# EAGLE design fish_electronics3 (EAGLE 6.3)
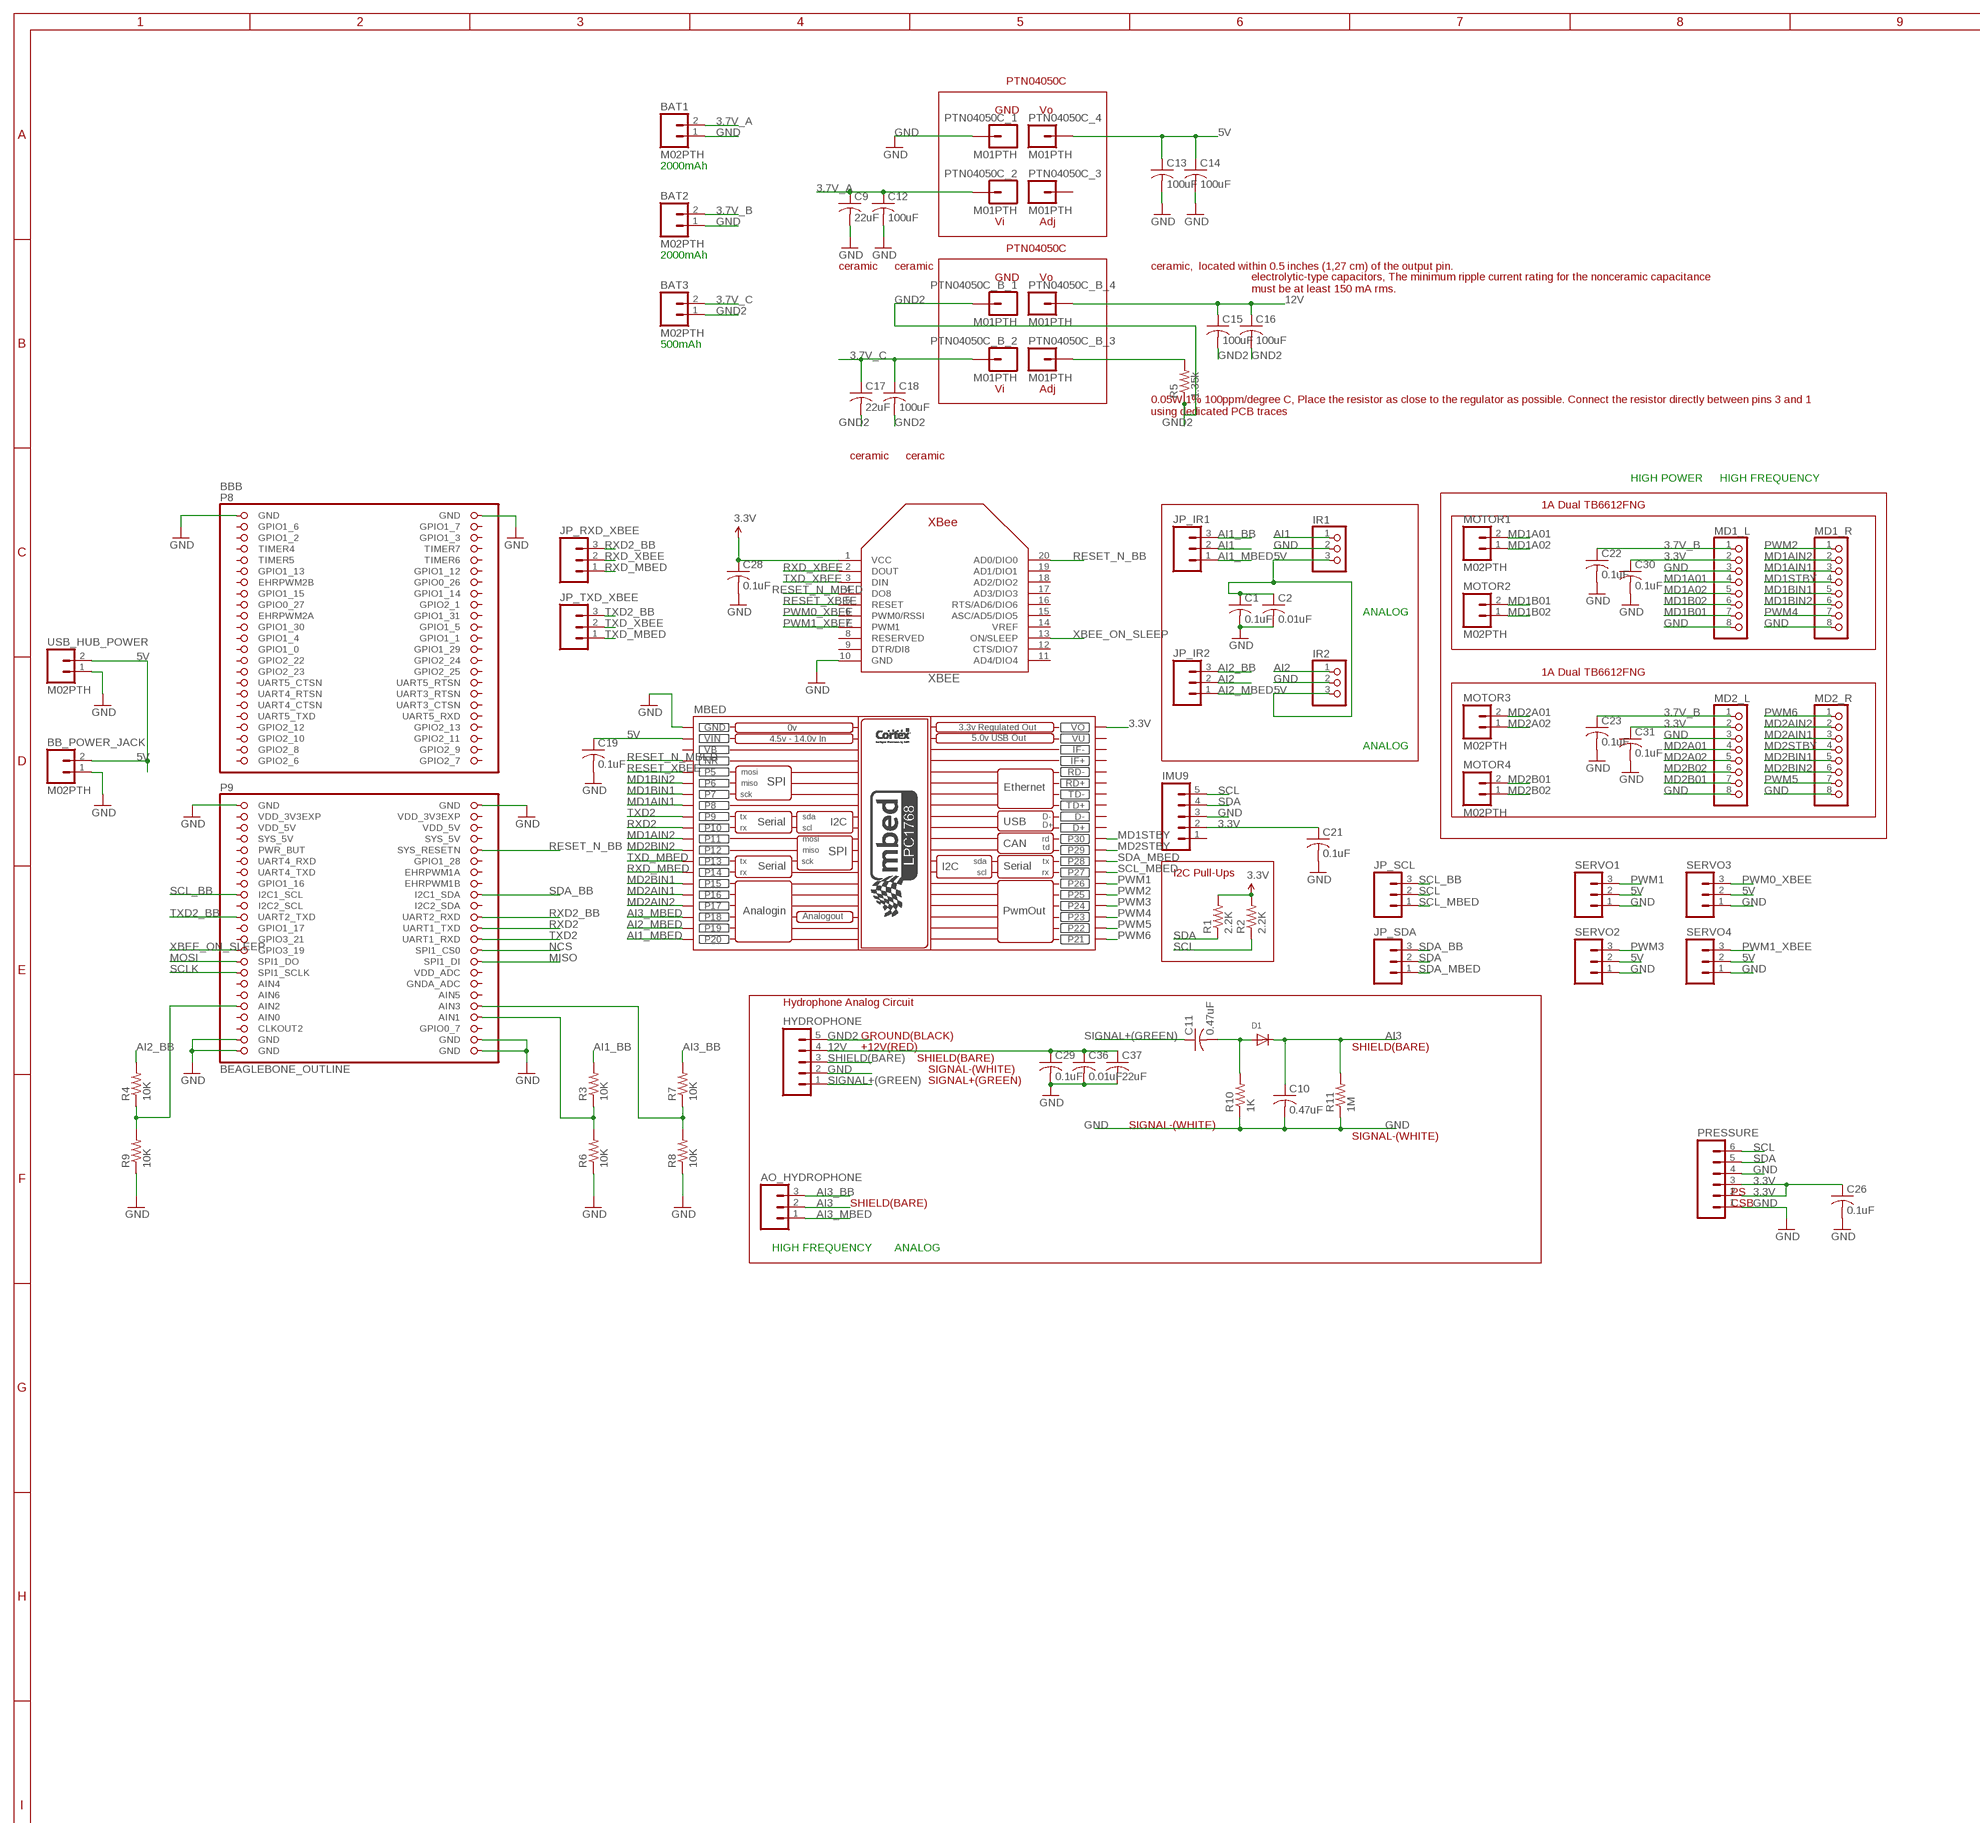
[diagram p0: schematic, sheet 1, part 1 of 2]
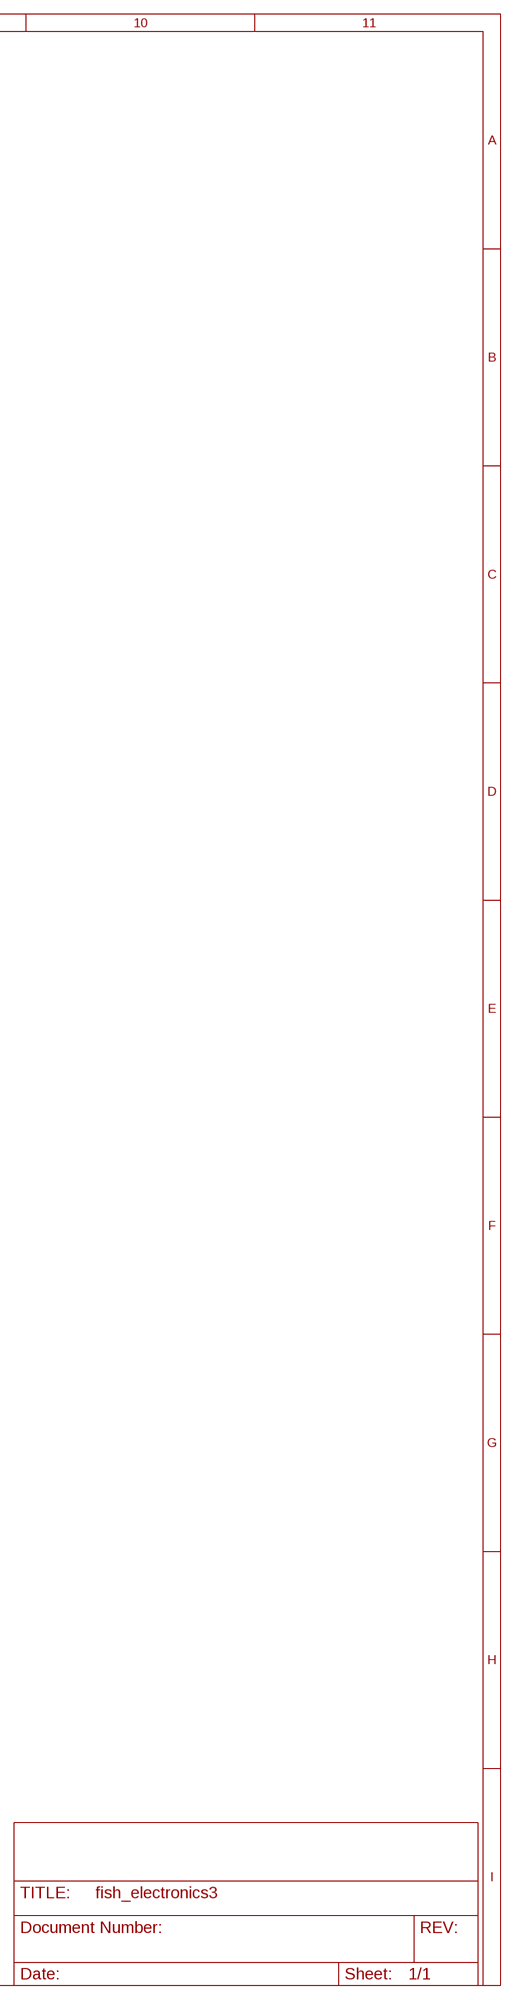
[diagram p1: schematic, sheet 1, part 2 of 2]

## Parts
AO_HYDROPHONE  M03PTH  [1X03]
BAT1  M02PTH  [1X02]
BAT2  M02PTH  [1X02]
BAT3  M02PTH  [1X02]
BB_POWER_JACK  M02PTH  [1X02]
BBB  BEAGLEBONE_OUTLINE  [BEAGLEBONE_SHIELD]
C1  0.1uF  C-USC0805  [C0805]
C2  0.01uF  C-USC0805  [C0805]
C9  22uF  C-USC0805  [C0805]
C10  0.47uF  C-USC0805  [C0805]
C11  0.47uF  C-USC0805  [C0805]
C12  100uF  C-USC1206  [C1206]
C13  100uF  C-USC1206  [C1206]
C14  100uF  C-USC1206  [C1206]
C15  100uF  C-USC1210  [C1210]
C16  100uF  C-USC1210  [C1210]
C17  22uF  C-USC0805  [C0805]
C18  100uF  C-USC1206  [C1206]
C19  0.1uF  C-USC0805  [C0805]
C21  0.1uF  C-USC0805  [C0805]
C22  0.1uF  C-USC0805  [C0805]
C23  0.1uF  C-USC0805  [C0805]
C26  0.1uF  C-USC0805  [C0805]
C28  0.1uF  C-USC0805  [C0805]
C29  0.1uF  C-USC0805  [C0805]
C30  0.1uF  C-USC0805  [C0805]
C31  0.1uF  C-USC0805  [C0805]
C36  0.01uF  C-USC0805  [C0805]
C37  22uF  C-USC0805  [C0805]
D1  DIODESOT23_WAVE  [SOT23-W]
HYDROPHONE  M05PTH  [1X05]
IMU9  M05PTH  [1X05]
IR1  PINHD-1X3CB  [1X03-CLEANBIG]
IR2  PINHD-1X3CB  [1X03-CLEANBIG]
JP_IR1  M03PTH  [1X03]
JP_IR2  M03PTH  [1X03]
JP_RXD_XBEE  M03PTH  [1X03]
JP_SCL  M03PTH  [1X03]
JP_SDA  M03PTH  [1X03]
JP_TXD_XBEE  M03PTH  [1X03]
MBED  MBED_NXP_LPC1768  [MBED-KIT]
MD1_L  PINHD-1X8  [1X08]
MD1_R  PINHD-1X8  [1X08]
MD2_L  PINHD-1X8  [1X08]
MD2_R  PINHD-1X8  [1X08]
MOTOR1  M02PTH  [1X02]
MOTOR2  M02PTH  [1X02]
MOTOR3  M02PTH  [1X02]
MOTOR4  M02PTH  [1X02]
PRESSURE  M06SIP  [1X06]
PTN04050C_1  M01PTH  [1X01]
PTN04050C_2  M01PTH  [1X01]
PTN04050C_3  M01PTH  [1X01]
PTN04050C_4  M01PTH  [1X01]
PTN04050C_B_1  M01PTH  [1X01]
PTN04050C_B_2  M01PTH  [1X01]
PTN04050C_B_3  M01PTH  [1X01]
PTN04050C_B_4  M01PTH  [1X01]
R1  2.2K  R-US_R0805  [R0805]
R2  2.2K  R-US_R0805  [R0805]
R3  10K  R-US_R0805  [R0805]
R4  10K  R-US_R0805  [R0805]
R5  1.35k  R-US_R0805  [R0805]
R6  10K  R-US_R0805  [R0805]
R7  10K  R-US_R0805  [R0805]
R8  10K  R-US_R0805  [R0805]
R9  10K  R-US_R0805  [R0805]
R10  1K  R-US_R0805  [R0805]
R11  1M  R-US_R0805  [R0805]
SERVO1  M03PTH  [1X03]
SERVO2  M03PTH  [1X03]
SERVO3  M03PTH  [1X03]
SERVO4  M03PTH  [1X03]
USB_HUB_POWER  M02PTH  [1X02]
XBEE  XBEE  [XBEE]

## Nets
3.3V: C21.1 C26.1 C28.1 C30.1 C31.1 IMU9.2 MBED.VOUT(VO) MD1_L.2 MD2_L.2 PRESSURE.2 PRESSURE.3 R1.2 R2.2 XBEE.1(VCC)
3.7V_A: BAT1.2 C9.1 C12.1 PTN04050C_2.1
3.7V_B: BAT2.2 C22.1 C23.1 MD1_L.1 MD2_L.1
3.7V_C: BAT3.2 C17.1 C18.1 PTN04050C_B_2.1
5V: BB_POWER_JACK.2 C1.1 C2.1 C13.1 C14.1 C19.1 IR1.3 IR2.3 MBED.VIN PTN04050C_4.1 SERVO1.2 SERVO2.2 SERVO3.2 SERVO4.2 USB_HUB_POWER.2
12V: C15.1 C16.1 C29.1 C36.1 C37.1 HYDROPHONE.4 PTN04050C_B_4.1
AI1: IR1.1 JP_IR1.2
AI1_BB: JP_IR1.3 R3.2
AI1_MBED: JP_IR1.1 MBED.P$20(P20)
AI2: IR2.1 JP_IR2.2
AI2_BB: JP_IR2.3 R4.2
AI2_MBED: JP_IR2.1 MBED.P$19(P19)
AI3: AO_HYDROPHONE.2 C10.1 D1.3(C) R11.2
AI3_BB: AO_HYDROPHONE.3 R7.2
AI3_MBED: AO_HYDROPHONE.1 MBED.P$18(P18)
GND: BAT1.1 BAT2.1 BB_POWER_JACK.1 BBB.1(GND) BBB.2(GND) BBB.47(GND) BBB.48(GND) BBB.89(GND) BBB.90(GND) BBB.91(GND) BBB.92(GND) C1.2 C2.2 C9.2 C10.2 C12.2 C13.2 C14.2 C19.2 C21.2 C22.2 C23.2 C26.2 C28.2 C29.2 C30.2 C31.2 C36.2 C37.2 HYDROPHONE.2 IMU9.3 IR1.2 IR2.2 MBED.GND MD1_L.3 MD1_L.8 MD1_R.8 MD2_L.3 MD2_L.8 MD2_R.8 PRESSURE.1 PRESSURE.4 PTN04050C_1.1 R6.1 R8.1 R9.1 R10.1 R11.1 SERVO1.1 SERVO2.1 SERVO3.1 SERVO4.1 USB_HUB_POWER.1 XBEE.10(GND)
GND2: BAT3.1 C15.2 C16.2 C17.2 C18.2 HYDROPHONE.5 PTN04050C_B_1.1 R5.1
MD1A01: MD1_L.4 MOTOR1.2
MD1A02: MD1_L.5 MOTOR1.1
MD1AIN1: MBED.P$8(P8) MD1_R.3
MD1AIN2: MBED.P$11(P11) MD1_R.2
MD1B01: MD1_L.7 MOTOR2.2
MD1B02: MD1_L.6 MOTOR2.1
MD1BIN1: MBED.P$7(P7) MD1_R.5
MD1BIN2: MBED.P$6(P6) MD1_R.6
MD1STBY: MBED.P$30(P30) MD1_R.4
MD2A01: MD2_L.4 MOTOR3.2
MD2A02: MD2_L.5 MOTOR3.1
MD2AIN1: MBED.P$16(P16) MD2_R.3
MD2AIN2: MBED.P$17(P17) MD2_R.2
MD2B01: MD2_L.7 MOTOR4.2
MD2B02: MD2_L.6 MOTOR4.1
MD2BIN1: MBED.P$15(P15) MD2_R.5
MD2BIN2: MBED.P$12(P12) MD2_R.6
MD2STBY: MBED.P$29(P29) MD2_R.4
MISO: BBB.76(SPI1_DI)
MOSI: BBB.75(SPI1_DO)
N$3: BBB.86(AIN1) R3.1 R6.2
N$4: PTN04050C_B_3.1 R5.2
N$6: BBB.84(AIN3) R7.1 R8.2
N$7: BBB.83(AIN2) R4.1 R9.2
N$10: C11.2 D1.1(A) R10.2
NCS: BBB.74(SPI1_CS0)
PWM0_XBEE: SERVO3.3 XBEE.6(PWM0/RSSI)
PWM1: MBED.P$26(P26) SERVO1.3
PWM1_XBEE: SERVO4.3 XBEE.7(PWM1)
PWM2: MBED.P$25(P25) MD1_R.1
PWM3: MBED.P$24(P24) SERVO2.3
PWM4: MBED.P$23(P23) MD1_R.7
PWM5: MBED.P$22(P22) MD2_R.7
PWM6: MBED.P$21(P21) MD2_R.1
RESET_N_BB: BBB.56(SYS_RESETN) XBEE.20(AD0/DIO0)
RESET_N_MBED: MBED.NR XBEE.4(DO8)
RESET_XBEE: MBED.P$5(P5) XBEE.5(RESET)
RXD2: BBB.70(UART1_TXD) MBED.P$10(P10)
RXD2_BB: BBB.68(UART2_RXD) JP_RXD_XBEE.3
RXD_MBED: JP_RXD_XBEE.1 MBED.P$14(P14)
RXD_XBEE: JP_RXD_XBEE.2 XBEE.2(DOUT)
SCL: IMU9.5 JP_SCL.2 PRESSURE.6 R2.1
SCL_BB: BBB.63(I2C1_SCL) JP_SCL.3
SCL_MBED: JP_SCL.1 MBED.P$27(P27)
SCLK: BBB.77(SPI1_SCLK)
SDA: IMU9.4 JP_SDA.2 PRESSURE.5 R1.1
SDA_BB: BBB.64(I2C1_SDA) JP_SDA.3
SDA_MBED: JP_SDA.1 MBED.P$28(P28)
SHIELD(BARE): HYDROPHONE.3
SIGNAL+(GREEN): C11.1 HYDROPHONE.1
TXD2: BBB.72(UART1_RXD) MBED.P$9(P9)
TXD2_BB: BBB.67(UART2_TXD) JP_TXD_XBEE.3
TXD_MBED: JP_TXD_XBEE.1 MBED.P$13(P13)
TXD_XBEE: JP_TXD_XBEE.2 XBEE.3(DIN)
XBEE_ON_SLEEP: BBB.73(GPIO3_19) XBEE.13(ON/SLEEP)
Unconnected: BBB.3(GPIO1_6) BBB.4(GPIO1_7) BBB.5(GPIO1_2) BBB.6(GPIO1_3) BBB.7(TIMER4) BBB.8(TIMER7) BBB.9(TIMER5) BBB.10(TIMER6) BBB.11(GPIO1_13) BBB.12(GPIO1_12) BBB.13(EHRPWM2B) BBB.14(GPIO0_26) BBB.15(GPIO1_15) BBB.16(GPIO1_14) BBB.17(GPIO0_27) BBB.18(GPIO2_1) BBB.19(EHRPWM2A) BBB.20(GPIO1_31) BBB.21(GPIO1_30) BBB.22(GPIO1_5) BBB.23(GPIO1_4) BBB.24(GPIO1_1) BBB.25(GPIO1_0) BBB.26(GPIO1_29) BBB.27(GPIO2_22) BBB.28(GPIO2_24) BBB.29(GPIO2_23) BBB.30(GPIO2_25) BBB.31(UART5_CTSN) BBB.32(UART5_RTSN) BBB.33(UART4_RTSN) BBB.34(UART3_RTSN) BBB.35(UART4_CTSN) BBB.36(UART3_CTSN) BBB.37(UART5_TXD) BBB.38(UART5_RXD) BBB.39(GPIO2_12) BBB.40(GPIO2_13) BBB.41(GPIO2_10) BBB.42(GPIO2_11) BBB.43(GPIO2_8) BBB.44(GPIO2_9) BBB.45(GPIO2_6) BBB.46(GPIO2_7) BBB.54(SYS_5V) BBB.55(PWR_BUT) BBB.57(UART4_RXD) BBB.58(GPIO1_28) BBB.59(UART4_TXD) BBB.60(EHRPWM1A) BBB.61(GPIO1_16) BBB.62(EHRPWM1B) BBB.65(I2C2_SCL) BBB.66(I2C2_SDA) BBB.69(GPIO1_17) BBB.71(GPIO3_21) BBB.78(VDD_ADC) BBB.79(AIN4) BBB.80(GNDA_ADC) BBB.81(AIN6) BBB.82(AIN5) BBB.87(CLKOUT2) BBB.88(GPIO0_7) IMU9.1 MBED.D+ MBED.D- MBED.IF+ MBED.IF- MBED.RD+ MBED.RD- MBED.TD+ MBED.TD- PTN04050C_3.1 XBEE.8(RESERVED) XBEE.9(DTR/DI8) XBEE.11(AD4/DIO4) XBEE.12(CTS/DIO7) XBEE.14(VREF) XBEE.15(ASC/AD5/DIO5) XBEE.16(RTS/AD6/DIO6) XBEE.17(AD3/DIO3) XBEE.18(AD2/DIO2) XBEE.19(AD1/DIO1)

## Notes on the sheet
- PTN04050C
- GND | Vo
- 2000mAh
- Vi | Adj
- PTN04050C
- 2000mAh
- ceramic | ceramic | ceramic,  located within 0.5 inches (1,27 cm) of the output pin.
- GND | Vo
- electrolytic-type capacitors, The minimum ripple current rating for the nonceramic capacitance
  must be at least 150 mA rms.
- 500mAh
- Vi | Adj
- 0.05W 1% 100ppm/degree C, Place the resistor as close to the regulator as possible. Connect the resistor directly between pins 3 and 1
  using dedicated PCB traces
- ceramic | ceramic
- HIGH POWER | HIGH FREQUENCY
- 1A Dual TB6612FNG
- ANALOG
- 1A Dual TB6612FNG
- ANALOG
- I2C Pull-Ups
- Hydrophone Analog Circuit
- GROUND(BLACK)
- +12V(RED) | SHIELD(BARE)
- SHIELD(BARE)
- SIGNAL-(WHITE)
- SIGNAL+(GREEN)
- SIGNAL-(WHITE)
- SIGNAL-(WHITE)
- PS
- SHIELD(BARE) | CSB
- HIGH FREQUENCY | ANALOG

## Power pins joined to a net without a drawn wire
AIN0: BBB.85(AIN0)
SYS_5V: BBB.53(SYS_5V)
VB: MBED.VB
VDD_3V3EXP: BBB.49(VDD_3V3EXP) BBB.50(VDD_3V3EXP)
VDD_5V: BBB.51(VDD_5V) BBB.52(VDD_5V)
VU: MBED.VU

## Library data of the parts
AO_HYDROPHONE JP_IR1 JP_IR2 JP_RXD_XBEE JP_SCL JP_SDA JP_TXD_XBEE SERVO1-SERVO4 = SparkFun:M03: Header 3 Standard 3-pin 0.1" header. Use with straight break away headers (SKU : PRT-00116), right angle break away headers (PRT-00553), swiss pins (PRT-00743), machine pins (PRT-00117), and female headers (PRT-00115). Molex polarized connector foot print use with SKU : PRT-08232 with associated crimp pins and housings.
BAT1-BAT3 BB_POWER_JACK MOTOR1-MOTOR4 USB_HUB_POWER = SparkFun-Connectors:M02: Standard 2-pin 0.1" header. Use with - straight break away headers ( PRT-00116) - right angle break away headers (PRT-00553) - swiss pins (PRT-00743) - machine pins (PRT-00117) - female headers (PRT-00115) Molex polarized connector foot print use with: PRT-08233 with associated crimp pins and housings. 2.54_SCREWTERM for use with PRT-10571. 3.5mm Screw Terminal footprints for PRT-08084 5mm Screw Terminal footprints for use with PRT-08433
BBB = adafruit2:BEAGLEBONE_OUTLINE: Should match A3 pinout - but not completely tested
C1 C2 C9-C11 C17 C19 C21-C23 C26 C28-C31 C36 C37 = rcl:C-US: CAPACITOR, American symbol
C12-C16 C18 = adafruit:C-US: CAPACITOR, American symbol
D1 = adafruit:DIODE: Diode SMADIODE - SMA Surface Mount Package 20V 1A Schottky Diode Digikey: 641-1014-6-ND DO-1N4148 - Through Hole Small Current Diode SOD-123 20V 1 A (.5mV Vf) Schottky Diode - Digikey: MBRX120TPMSCT-ND SOD-323 10V 570mA (.38mV Vf, 3ns) Schottky Diode - Digikey: ZLLS410CT-ND SOD-523 30V 30mA Schottky Diode (RB751S-40TE61) - Digikey: RB751S-40TE61CT-ND SOT23-R/W - SOT23 Package (R = Solder Paste/Reflow Ovens, W = Hand-Soldering) BAT54Film 40V 300mA - Digikey: 497-7162-1-ND
HYDROPHONE = SparkFun-Connectors:M05: Header 5 Standard 5-pin 0.1" header. Use with straight break away headers (SKU : PRT-00116), right angle break away headers (PRT-00553), swiss pins (PRT-00743), machine pins (PRT-00117), and female headers (PRT-00115). Molex polarized connector foot print use with SKU : PRT-08230 with associated crimp pins and housings.
IMU9 = SparkFun:M05: Header 5 Standard 5-pin 0.1" header. Use with straight break away headers (SKU : PRT-00116), right angle break away headers (PRT-00553), swiss pins (PRT-00743), machine pins (PRT-00117), and female headers (PRT-00115). Molex polarized connector foot print use with SKU : PRT-08230 with associated crimp pins and housings.
IR1 IR2 = adafruit:PINHD-1X3: PIN HEADER
MBED = MBED_v2.1:MBED_NXP_LPC1768: Mbed LPC1768 - ARM CORTEX v2.1 * Schematic symbol is now placed in eagles's default raster. *The pads diameter are suitable for routing between mbed pins * mbed pads are 0.8 mm drill diameter. --------------------------------------------- Created by: Mohamed Yousry *Alexandria, Egypt *Email: mohamed.yousry@ieeegoldegypt.org
MD1_L MD1_R MD2_L MD2_R = pinhead2:PINHD-1X8: PIN HEADER
PRESSURE = SparkFun-Connectors:M06: Header 6 Standard 6-pin 0.1" header. Use with straight break away headers (SKU : PRT-00116), right angle break away headers (PRT-00553), swiss pins (PRT-00743), machine pins (PRT-00117), and female headers (PRT-00115). Molex polarized connector foot print use with SKU : PRT-08094 with associated crimp pins and housings. NOTES ON THE VARIANTS LOCK and LOCK_LONGPADS... This footprint was designed to help hold the alignment of a through-hole component (i.e. 6-pin header) while soldering it into place. You may notice that each hole has been shifted either up or down by 0.005 of an inch from it's more standard position (which is a perfectly straight line). This slight alteration caused the pins (the squares in the middle) to touch the edges of the holes. Because they are alternating, it causes a "brace" to hold the component in place. 0.005 has proven to be the perfect amount of "off-center" position when using our standard breakaway headers. Although looks a little odd when you look at the bare footprint, once you have a header in there, the alteration is very hard to notice. Also,if you push a header all the way into place, it is covered up entirely on the bottom side. This idea of altering the position of holes to aid alignment will be further integrated into the Sparkfun Library for other footprints. It can help hold any component with 3 or more connection pins.
PTN04050C_1-PTN04050C_4 PTN04050C_B_1-PTN04050C_B_4 = SparkFun:M01: Header 1 Standard 1-pin 0.1" header. Use with straight break away headers (SKU : PRT-00116), right angle break away headers (PRT-00553), swiss pins (PRT-00743), machine pins (PRT-00117), and female headers (PRT-00115).
R1-R11 = rcl:R-US_: RESISTOR, American symbol
XBEE = adafruit:XBEE

## Net classes
1 Power1: width 0.254 mm, drill 0.508 mm, clearance 0.254 mm
2 Gound1: width 0.254 mm, drill 0.508 mm, clearance 0.254 mm
4 xxwide: width 0.203 mm
5 Power3: width 0.305 mm, drill 0.508 mm, clearance 0.254 mm
6 Gound3: width 0.305 mm, drill 0.508 mm, clearance 0.254 mm

## Board
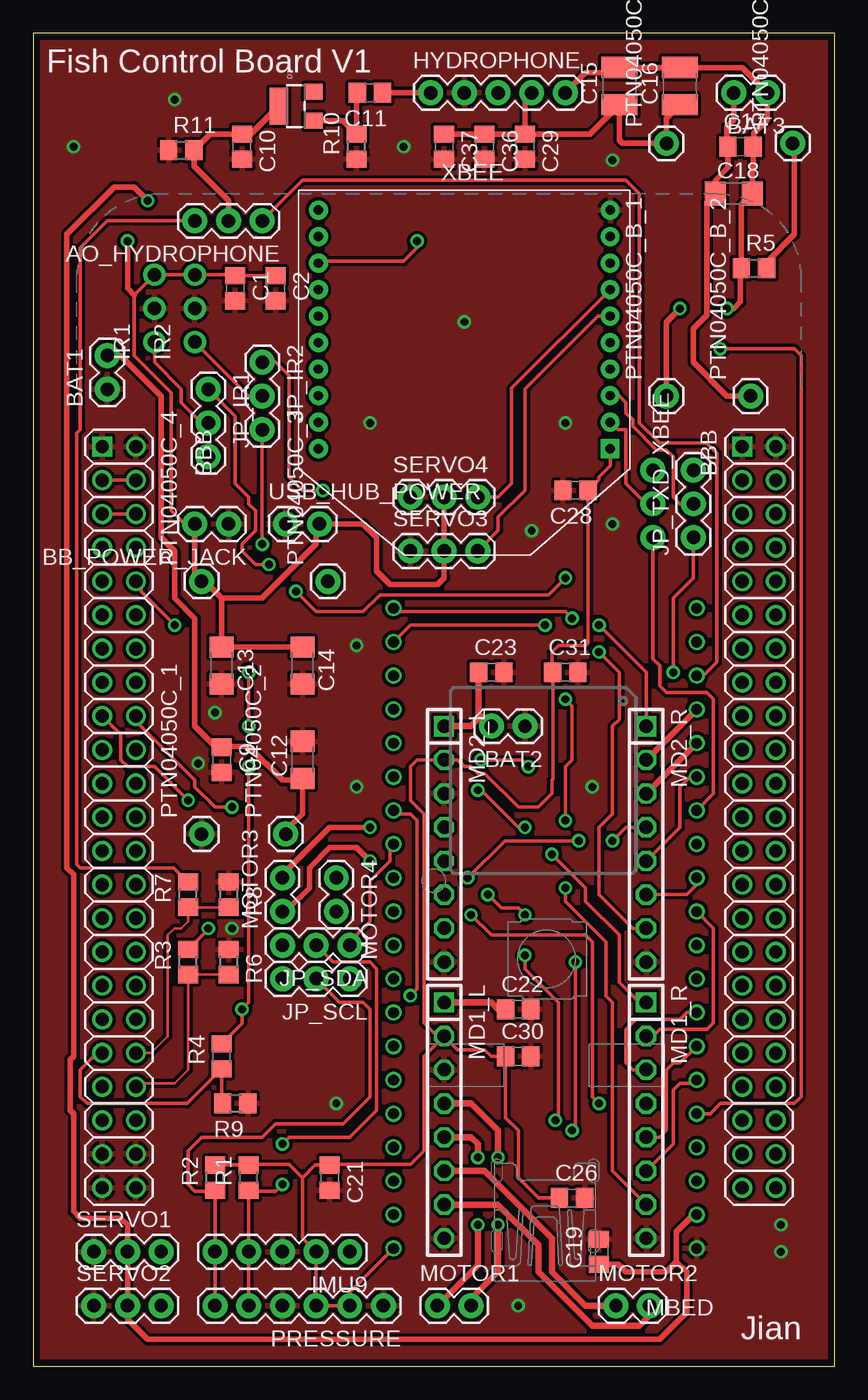
[diagram p2: board, top side]
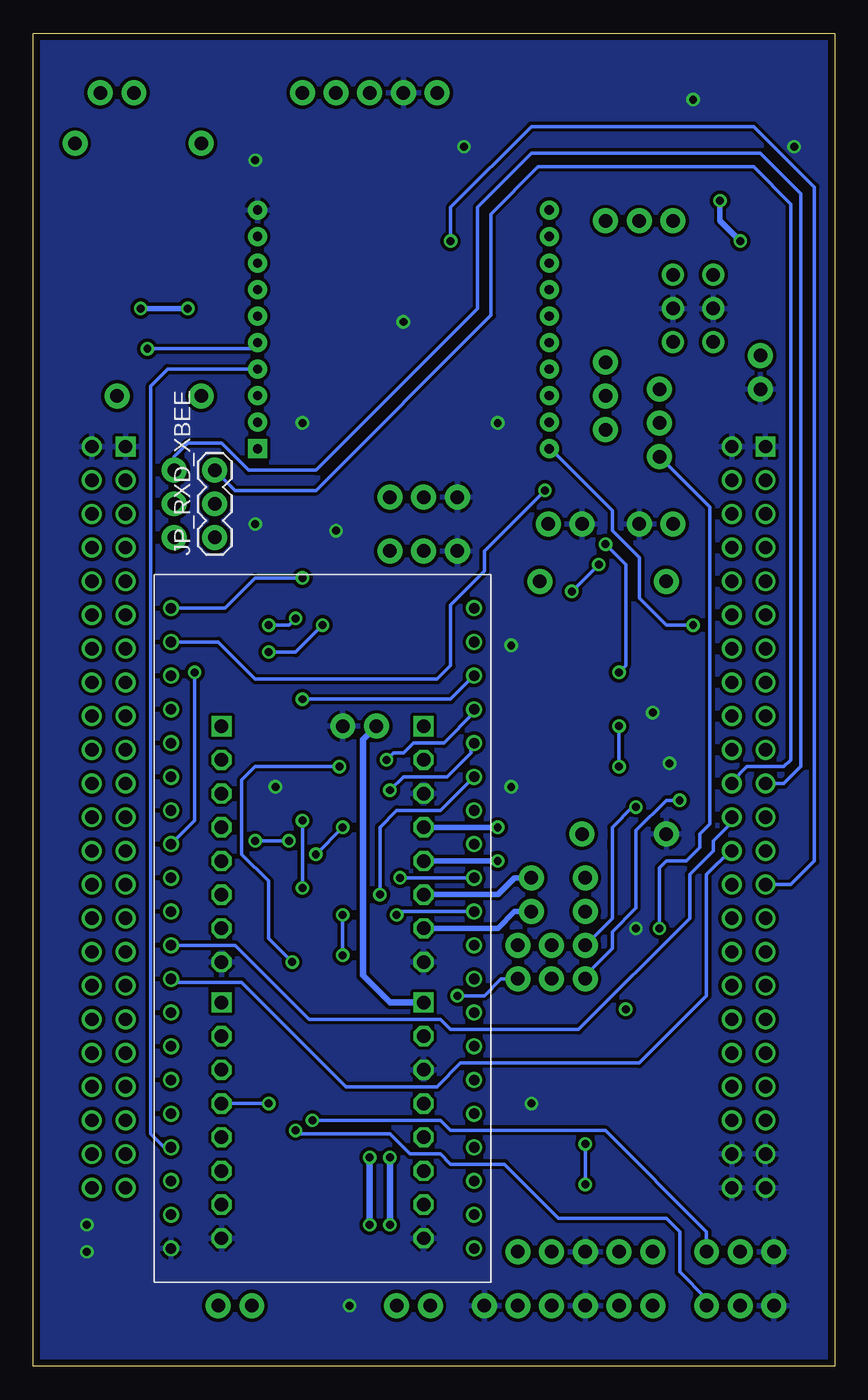
[diagram p3: board, bottom side, seen from below]

Size 60.43 x 100.51 mm. Coordinates in mm from the lower left corner, seen from the top.
Outline: 0,0 60.43,0 60.43,100.51 0,100.51 0,0
Copper layers (1*16): Top 0.0178mm / dielectric 59mil / Bottom 0.0178mm
Design rules "SSC-EAGLE-2Lyr_v1.0.0.3": minimum track width 6mil, minimum drill 14mil, track to track 6mil, track to pad 6mil, pad to pad 6mil, via to via 6mil, smd to smd 6mil, copper to edge 20mil, drill to drill 16mil, minimum pad ring 8mil, minimum via ring 8mil, stop-mask expansion 3mil, vias tented up to drill 0mil, thermal gap 10mil

### Footprints (pad centres in the part's own frame; a part is rotated, then mirrored left to right if it is on the bottom)
1X03 = drill 1.016 pad 1.88: 1 0,0; 2 2.54,0; 3 5.08,0
1X02 = drill 1.016 pad 1.88: 1 0,0; 2 2.54,0
BEAGLEBONE_SHIELD = drill 1 square: 1 4.445,19.05; 47 52.705,19.05 | drill 1: 2 1.905,19.05; 3 4.445,21.59; 4 1.905,21.59; 5 4.445,24.13; 6 1.905,24.13; 7 4.445,26.67; 8 1.905,26.67; 9 4.445,29.21; 10 1.905,29.21; 11 4.445,31.75; 12 1.905,31.75; 13 4.445,34.29; 14 1.905,34.29; 15 4.445,36.83; 16 1.905,36.83; 17 4.445,39.37; 18 1.905,39.37; 19 4.445,41.91; 20 1.905,41.91; 21 4.445,44.45; 22 1.905,44.45; 23 4.445,46.99; 24 1.905,46.99; 25 4.445,49.53; 26 1.905,49.53; 27 4.445,52.07; 28 1.905,52.07; 29 4.445,54.61; 30 1.905,54.61; 31 4.445,57.15; 32 1.905,57.15; 33 4.445,59.69; 34 1.905,59.69; 35 4.445,62.23; 36 1.905,62.23; 37 4.445,64.77; 38 1.905,64.77; 39 4.445,67.31; 40 1.905,67.31; 41 4.445,69.85; 42 1.905,69.85; 43 4.445,72.39; 44 1.905,72.39; 45 4.445,74.93; 46 1.905,74.93; 48 50.165,19.05; 49 52.705,21.59; 50 50.165,21.59; 51 52.705,24.13; 52 50.165,24.13; 53 52.705,26.67; 54 50.165,26.67; 55 52.705,29.21; 56 50.165,29.21; 57 52.705,31.75; 58 50.165,31.75; 59 52.705,34.29; 60 50.165,34.29; 61 52.705,36.83; 62 50.165,36.83; 63 52.705,39.37; 64 50.165,39.37; 65 52.705,41.91; 66 50.165,41.91; 67 52.705,44.45; 68 50.165,44.45; 69 52.705,46.99; 70 50.165,46.99; 71 52.705,49.53; 72 50.165,49.53; 73 52.705,52.07; 74 50.165,52.07; 75 52.705,54.61; 76 50.165,54.61; 77 52.705,57.15; 78 50.165,57.15; 79 52.705,59.69; 80 50.165,59.69; 81 52.705,62.23; 82 50.165,62.23; 83 52.705,64.77; 84 50.165,64.77; 85 52.705,67.31; 86 50.165,67.31; 87 52.705,69.85; 88 50.165,69.85; 89 52.705,72.39; 90 50.165,72.39; 91 52.705,74.93; 92 50.165,74.93
C0805 = smd 1.3 x 1.5: 1 -0.95,0; 2 0.95,0
C1206 = smd 1.6 x 1.8: 1 -1.4,0; 2 1.4,0
C1210 = smd 1.6 x 2.7: 1 -1.4,0; 2 1.4,0
SOT23-W = smd 1.2 x 1.4: 1 -1.1,-1.3; 2 1.1,-1.3 | smd 2.8 x 1.4: 3 0,1.3
1X05 = drill 1.016 pad 1.88: 1 0,0; 2 2.54,0; 3 5.08,0; 4 7.62,0; 5 10.16,0
1X03-CLEANBIG = drill 1.016 pad 1.676: 1 -2.54,0; 2 0,0; 3 2.54,0
MBED-KIT = drill 0.8: D+ 11.43,1.27; D- 11.43,3.81; GND -11.43,24.13; IF+ 11.43,16.51; IF- 11.43,19.05; NR -11.43,16.51; P$5 -11.43,13.97; P$6 -11.43,11.43; P$7 -11.43,8.89; P$8 -11.43,6.35; P$9 -11.43,3.81; P$10 -11.43,1.27; P$11 -11.43,-1.27; P$12 -11.43,-3.81; P$13 -11.43,-6.35; P$14 -11.43,-8.89; P$15 -11.43,-11.43; P$16 -11.43,-13.97; P$17 -11.43,-16.51; P$18 -11.43,-19.05; P$19 -11.43,-21.59; P$20 -11.43,-24.13; P$21 11.43,-24.13; P$22 11.43,-21.59; P$23 11.43,-19.05; P$24 11.43,-16.51; P$25 11.43,-13.97; P$26 11.43,-11.43; P$27 11.43,-8.89; P$28 11.43,-6.35; P$29 11.43,-3.81; P$30 11.43,-1.27; RD+ 11.43,11.43; RD- 11.43,13.97; TD+ 11.43,6.35; TD- 11.43,8.89; VB -11.43,19.05; VIN -11.43,21.59; VOUT 11.43,24.13; VU 11.43,21.59
1X08 = drill 1.016 square: 1 -8.89,0 | drill 1.016 octagon: 2 -6.35,0; 3 -3.81,0; 4 -1.27,0; 5 1.27,0; 6 3.81,0; 7 6.35,0; 8 8.89,0
1X06 = drill 1.016 pad 1.88: 1 0,0; 2 2.54,0; 3 5.08,0; 4 7.62,0; 5 10.16,0; 6 12.7,0
1X01 = drill 1.016 pad 1.88: 1 0,0
R0805 = smd 1.3 x 1.5: 1 -0.95,0; 2 0.95,0
XBEE = drill 0.7 pad 1.422 square: 1 -11,5.5 | drill 0.7 pad 1.422: 2 -11,3.5; 3 -11,1.5; 4 -11,-0.5; 5 -11,-2.5; 6 -11,-4.5; 7 -11,-6.5; 8 -11,-8.5; 9 -11,-10.5; 10 -11,-12.5; 11 11,-12.5; 12 11,-10.5; 13 11,-8.5; 14 11,-6.5; 15 11,-4.5; 16 11,-2.5; 17 11,-0.5; 18 11,1.5; 19 11,3.5; 20 11,5.5

### Placement (x,y rotation side)
AO_HYDROPHONE  17.27,86.36 180 top
BAT1  5.59,73.66 90 top
BAT2  37.08,48.26 180 top
BAT3  55.37,96.01 180 top
BB_POWER_JACK  14.73,63.5 180 top
BBB  57.91,88.39 180 top
C1  15.24,81.28 270 top
C2  18.29,81.28 270 top
C9  14.22,45.72 270 top
C10  15.75,91.95 270 top
C11  25.4,96.01 180 top
C12  20.32,45.72 90 top
C13  14.22,52.83 270 top
C14  20.32,52.83 270 top
C15  44.2,96.52 90 top
C16  48.77,96.52 90 top
C17  53.34,91.95 0 top
C18  52.83,88.39 0 top
C19  42.67,8.64 90 top
C21  22.35,14.22 270 top
C22  36.58,26.92 0 top
C23  34.54,52.32 0 top
C26  40.64,12.7 0 top
C28  40.89,66.04 180 top
C29  37.08,91.95 270 top
C30  36.58,23.37 0 top
C31  40.13,52.32 0 top
C36  34.04,91.95 270 top
C37  30.99,91.95 270 top
D1  19.81,95 90 top
HYDROPHONE  29.97,96.01 0 top
IMU9  23.88,8.64 180 top
IR1  9.14,79.76 90 top
IR2  12.19,79.76 90 top
JP_IR1  13.21,73.66 270 top
JP_IR2  17.27,75.69 270 top
JP_RXD_XBEE  46.74,62.48 90 bottom
JP_SCL  23.88,29.21 180 top
JP_SDA  23.88,31.75 180 top
JP_TXD_XBEE  49.78,62.48 90 top
MBED  38.61,33.02 180 top
MD1_L  30.99,18.54 270 top
MD1_R  46.23,18.54 270 top
MD2_L  30.99,39.37 270 top
MD2_R  46.23,39.37 270 top
MOTOR1  30.48,4.57 0 top
MOTOR2  43.94,4.57 0 top
MOTOR3  18.8,34.29 90 top
MOTOR4  22.86,36.83 270 top
PRESSURE  26.42,4.57 180 top
PTN04050C_1  12.7,40.13 90 top
PTN04050C_2  19.05,40.13 90 top
PTN04050C_3  22.23,59.18 90 top
PTN04050C_4  12.7,59.18 90 top
PTN04050C_B_1  47.75,73.15 90 top
PTN04050C_B_2  54.1,73.15 90 top
PTN04050C_B_3  57.28,92.2 90 top
PTN04050C_B_4  47.75,92.2 90 top
R1  16.26,14.22 90 top
R2  13.72,14.22 90 top
R3  11.68,30.48 90 top
R4  14.22,23.37 90 top
R5  54.36,82.8 0 top
R6  14.73,30.48 270 top
R7  11.68,35.56 90 top
R8  14.73,35.56 270 top
R9  15.24,19.81 180 top
R10  24.38,91.95 90 top
R11  11.18,91.69 0 top
SERVO1  4.57,8.64 0 top
SERVO2  4.57,4.57 0 top
SERVO3  28.45,61.47 0 top
SERVO4  28.45,65.53 0 top
USB_HUB_POWER  19.05,63.5 0 top
XBEE  32.51,74.68 180 top

### Tracks (layer width: path | path; a pad name or v marks a point on that pad's centre or on a via)
3.3V
  Top 0.254: XBEE.1 43.51,67.9 42.67,67.06 42.67,66.87 C28.1 41.84,54.54 41.66,54.36 39.62,54.36 39.12,53.85 39.12,52.39 C31.1 39.18,44.26 39.12,44.2 39.12,43.18 38.1,42.16 36.58,42.16 34.04,44.7 33.53,44.7 33.02,45.21 32.51,45.21 32,45.72 MD2_L.2 28.96,45.72 28.45,45.21 28.45,42.67 29.46,41.66 29.46,25.91 30.48,24.89 MD1_L.2 | MBED.VOUT 23.88,5.59 PRESSURE.2 PRESSURE.3 IMU9.2 20.32,9.65 20.32,14.22 | 20.32,14.22 21.27,15.17 C21.1 22.42,15.24 28.45,15.24 29.46,16.26 29.46,23.37 MD1_L.2 | R2.2 R1.2 16.32,15.24 19.3,15.24 20.32,14.22 | C26.1 38.1,12.7 36.58,14.22 36.58,17.78 35.63,18.73 C30.1 34.54,23.37 34.04,23.88 32,23.88 MD1_L.2
3.7V_A
  Top 0.406: PTN04050C_2.1 19.05,40.39 20.32,41.66 C12.1 19.94,44.32 19.81,44.2 18.8,44.2 16.26,46.74 14.29,46.74 C9.1 | BAT1.2 6.6,76.2 9.65,73.15 9.65,62.48 10.67,61.47 10.67,57.91 12.19,56.39 12.19,48.26 13.72,46.74
  Top 0.508: 13.72,46.74 14.16,46.74 C9.1
3.7V_B
  Top 0.508: BAT2.2 33.78,49.02 | 33.78,49.02 33.59,49.21 C23.1 | 33.78,49.02 33.02,48.26 MD2_L.1 | C22.1 35.05,26.92 34.54,27.43 MD1_L.1
  Bottom 0.508: BAT2.2 35.56,47.24 35.56,29.46 33.53,27.43 MD1_L.1
3.7V_C
  Top 0.406: BAT3.2 52.83,93.98 52.32,93.47 52.32,92.01 C17.1 52.39,90.36 51.43,89.4 C18.1 50.8,87.76 50.8,79.25 49.78,78.23 49.78,75.69 52.32,73.15 PTN04050C_B_2.1
5V  (via drill 0.6)
  Top 0.254: C2.1 C1.1 15.24,82.3 IR2.3 IR1.3 7.62,80.77 7.62,76.2 10.41,73.41 10.41,64.52 11.43,63.5 BB_POWER_JACK.2
  Top 0.406: C14.1 C13.1 14.22,57.91 | 14.22,57.91 13.21,58.93 12.95,58.93 PTN04050C_4.1 12.19,59.69 BB_POWER_JACK.2 | 14.22,57.91 17.27,57.91 21.34,61.98 21.34,63.25 USB_HUB_POWER.2 24.89,63.5 25.91,62.48 25.91,59.94 26.92,58.93 30.48,58.93 30.99,59.44 SERVO3.2 SERVO4.2 | 48.51,7.87 47.75,7.11 44.7,7.11 44.13,7.69 C19.1 | 48.51,7.87 48.51,10.16 49.78,11.43 MBED.VIN | 48.51,7.87 49.28,7.11 49.28,4.06 47.24,2.03 8.64,2.03 7.11,3.56 SERVO2.2 SERVO1.2 7.11,10.67 6.6,11.18 3.56,11.18 3.05,11.68 3.05,19.05 2.79,19.3 2.79,23.11 3.05,23.37 3.05,37.08 2.54,37.59 2.54,85.34 6.1,88.9 7.62,88.9 v8.64,87.88 | v7.11,84.84 7.11,81.28 7.62,80.77
  Bottom 0.406: v8.64,87.88 8.64,86.36 v7.11,84.84
12V
  Top 0.406: 47.82,92.14 PTN04050C_B_4.1 | PTN04050C_B_4.1 44.45,92.2 44.2,92.46 C15.1 41.97,92.9 C29.1 | C29.1 C36.1 C37.1 | HYDROPHONE.4 37.08,95.5 C29.1 | C16.1 47.75,94.1 PTN04050C_B_4.1
AI1
  Top 0.254: IR1.1 9.14,75.69 11.18,73.66 11.18,72.64 12.7,71.12 JP_IR1.2
AI1_BB  (via drill 0.6)
  Top 0.254: v13.21,33.02 13.21,32.95 R3.2
  Bottom 0.254: JP_IR1.3 9.4,64.77 9.4,40.89 10.16,40.13 10.16,39.12 11.18,38.1 12.7,38.1 13.21,37.59 v13.21,33.02
AI1_MBED  (via drill 0.6)
  Top 0.254: JP_IR1.1 15.24,71.63 15.24,66.55 16.26,65.53 16.26,65.02 16.76,64.52 16.76,62.99 15.75,61.98 15.75,61.47 16.76,60.45 v17.78,60.45 | v40.13,59.44 38.86,58.17 26.16,58.17 24.89,56.9 21.34,56.9 v19.81,58.42
  Bottom 0.254: v17.78,60.45 v19.81,58.42 | MBED.P$20 45.97,57.15 43.69,59.44 v40.13,59.44
AI2
  Top 0.254: IR2.1 16.26,73.15 JP_IR2.2
AI2_BB  (via drill 0.6)
  Top 0.254: R4.2 15.75,25.84 v15.75,26.92 16.26,27.43 v16.26,45.21 | v16.26,52.32 v16.26,48.26 | v17.27,61.98 JP_IR2.3
  Bottom 0.254: v16.26,52.32 15.75,52.83 15.75,60.45 v17.27,61.98 | v16.26,48.26 v16.26,45.21
AI2_MBED  (via drill 0.6)
  Top 0.254: v21.84,66.04 20.32,66.04 19.3,67.06 19.3,74.68 18.29,75.69 JP_IR2.1
  Bottom 0.254: v21.84,66.04 26.42,61.47 26.42,59.94 28.96,57.4 28.96,52.83 29.97,51.82 43.69,51.82 46.48,54.61 MBED.P$19
AI3
  Top 0.406: D1.3 16.41,92.9 C10.1 13.33,92.9 R11.2 12.13,90.49 14.73,87.88 AO_HYDROPHONE.2
AI3_BB
  Top 0.254: AO_HYDROPHONE.3 5.59,86.36 3.56,84.33 3.56,70.61 3.3,70.36 3.3,37.85 3.56,37.59 10.6,37.59 R7.2
AI3_MBED
  Top 0.254: AO_HYDROPHONE.1 20.32,89.41 44.7,89.41 45.72,88.39 45.72,71.12 47.24,69.6 50.8,69.6 51.56,68.83 51.56,53.09 50.55,52.07 MBED.P$18
GND  (via drill 0.6)
  other vias: 32.51,78.74 40.13,71.12 3.05,91.95 43.69,90.93 22.86,19.81 42.16,43.69 13.72,49.28 14.99,33.02 12.45,45.47 10.67,95.5 56.39,10.67 36.58,4.57 24.38,54.36 24.38,43.69 25.4,71.12 43.69,63.5 37.59,62.99 27.94,91.95 56.39,8.64
  pour Top (isolate 0.254): 0,100.58 0,0 60.45,0 60.45,100.58
  pour Bottom (isolate 0.254): 0,100.58 0,0 60.45,0 60.45,100.58
GND2  (via drill 0.6)
  Top 0.406: R5.1 53.41,82.36 | PTN04050C_B_1.1 47.75,78.74 v48.77,79.76 | v52.32,79.76 52.83,79.76 53.34,80.26 53.34,82.74 R5.1 | R5.1 53.41,87.57 C18.2 54.23,90.43 54.29,90.49 C17.2 54.36,92.01 54.36,92.96 55.37,93.98 BAT3.1 53.46,97.92 C16.2 C15.2 43.81,97.54 41.66,97.54 HYDROPHONE.5
  Bottom 0.406: v48.77,79.76 v52.32,79.76
MD1A01  (via drill 0.6)
  Top 0.508: MOTOR1.2 33.02,5.08 35.05,7.11 v35.05,10.67 | v35.05,15.75 35.05,17.78 33.02,19.81 MD1_L.4
  Bottom 0.508: v35.05,10.67 v35.05,15.75
MD1A02  (via drill 0.6)
  Top 0.508: MOTOR1.1 33.53,7.62 v33.53,10.67 | v33.53,15.75 33.53,16.76 33.02,17.27 MD1_L.5
  Bottom 0.508: v33.53,10.67 v33.53,15.75
MD1AIN1
  Top 0.254: MBED.P$8 49.28,26.67 48.77,26.16 45.47,26.16 44.7,25.4 44.7,22.86 45.21,22.35 MD1_R.3
MD1AIN2
  Top 0.254: MBED.P$11 51.31,33.02 51.31,25.91 50.8,25.4 47.24,25.4 46.74,24.89 MD1_R.2
MD1B01
  Top 0.508: MOTOR2.2 46.48,3.81 45.72,3.05 42.16,3.05 38.1,7.11 38.1,9.14 35.05,12.19 MD1_L.7
MD1B02
  Top 0.508: MOTOR2.1 41.66,4.57 39.12,7.11 39.12,9.65 34.04,14.73 MD1_L.6
MD1BIN1
  Top 0.254: MBED.P$7 48.77,22.86 48.26,22.86 47.75,22.35 47.75,17.78 47.24,17.27 MD1_R.5
MD1BIN2
  Top 0.254: MBED.P$6 49.78,21.34 48.77,21.34 48.26,20.83 48.26,16.76 MD1_R.6
MD1STBY  (via drill 0.6)
  Top 0.254: v33.02,34.04 34.54,32.51 41.66,32.51 42.16,32 42.16,20.32 v42.67,19.81
  Bottom 0.254: MBED.P$30 32.77,34.29 v33.02,34.04 | v42.67,19.81 MD1_R.4
MD2A01  (via drill 0.6)
  Top 0.406: MOTOR3.2 18.8,37.08 22.35,40.64 v25.4,40.64
  Bottom 0.406: v25.4,40.64 MD2_L.4
MD2A02  (via drill 0.6)
  Top 0.406: MOTOR3.1 19.05,34.29 20.83,36.07 20.83,37.59 22.35,39.12 24.38,39.12 v25.4,38.1
  Bottom 0.406: v25.4,38.1 MD2_L.5
MD2AIN1
  Top 0.406: MD2_R.3 MBED.P$16
MD2AIN2
  Top 0.406: MBED.P$17 MD2_R.2
MD2B01
  Bottom 0.406: MOTOR4.2 24.13,34.29 25.4,33.02 MD2_L.7
MD2B02
  Bottom 0.406: MOTOR4.1 24.13,36.83 25.4,35.56 MD2_L.6
MD2BIN1
  Top 0.254: MBED.P$15 49.53,44.45 48.77,43.69 48.77,40.64 MD2_R.5
MD2BIN2
  Top 0.254: MBED.P$12 50.04,36.32 49.28,35.56 MD2_R.6
MD2STBY  (via drill 0.6)
  Top 0.254: MD2_R.4 44.7,40.64 v43.69,39.62 | v41.15,39.62 35.56,39.62 v32.77,36.83
  Bottom 0.254: v43.69,39.62 v41.15,39.62 | v32.77,36.83 MBED.P$29
N$3
  Top 0.203: R6.2 R3.1 11.68,22.35 10.67,21.34 8,21.34 BBB.86
N$4
  Top 0.406: PTN04050C_B_3.1 57.4,92.08 57.4,85.34 55.31,83.25 R5.2
N$6
  Top 0.203: R8.2 R7.1 11.68,33.53 11.18,33.02 10.67,33.02 10.16,32.51 10.16,24.89 8.89,23.62 BBB.84
N$7
  Top 0.254: R9.2 14.22,19.88 R4.1 11.62,19.81 4.06,19.81 3.56,20.32 3.56,22.35 4.83,23.62 BBB.83
N$10
  Top 0.406: C11.2 24.38,95.95 R10.2 23.39,93.9 D1.1
PWM0_XBEE
  Top 0.254: XBEE.6 42.6,79.18 37.08,73.66 37.08,66.04 35.05,64.01 35.05,62.99 SERVO3.3
PWM1  (via drill 0.6)
  Top 0.254: v39.37,18.54 39.62,18.8 39.62,27.43 37.08,29.97 v37.08,30.99 | v37.08,34.04 36.58,34.54 35.31,34.54 v34.29,35.56
  Bottom 0.254: SERVO1.3 9.65,10.16 17.27,17.78 28.96,17.78 29.72,18.54 v39.37,18.54 | v37.08,30.99 v37.08,34.04 | v34.29,35.56 34.29,40.64 33.02,41.91 29.72,41.91 MBED.P$26
PWM1_XBEE
  Top 0.254: SERVO4.3 35.05,65.53 36.07,66.55 36.07,73.73 XBEE.7
PWM2  (via drill 0.6)
  Top 0.254: MD1_R.1 45.72,27.43 44.2,28.96 44.2,32.51 41.66,35.05 41.66,36.07 v39.12,38.61 | v33.53,43.43 33.78,43.43 36.58,40.64 v37.08,40.64
  Bottom 0.254: v39.12,38.61 v37.08,40.64 | MBED.P$25 27.43,46.74 27.43,46.23 29.21,44.45 32.51,44.45 v33.53,43.43
PWM3  (via drill 0.6)
  Top 0.254: v40.89,30.48 40.89,18.03 v40.64,17.78 | v37.34,45.21 36.96,45.59 36.83,45.72 v33.78,45.72
  Bottom 0.254: SERVO2.3 9.65,5.08 11.68,7.11 11.68,10.16 12.7,11.18 20.83,11.18 24.89,15.24 28.96,15.24 29.72,16 32,16 33.53,17.53 40.39,17.53 v40.64,17.78 | MBED.P$24 27.18,49.28 29.46,46.99 31.75,46.99 32.51,46.23 33.27,46.23 v33.78,45.72 | v37.34,45.21 43.69,45.21 44.7,44.2 44.7,38.61 42.67,36.58 42.67,32.26 v40.89,30.48
PWM4  (via drill 0.6)
  Top 0.254: MD1_R.7 43.69,14.73 43.69,27.43 43.18,27.94 43.18,32 40.13,35.05 v40.13,36.07 | v40.13,41.15 40.13,45.21 40.64,45.72 40.64,49.78 v40.13,50.29
  Bottom 0.254: v40.13,36.07 v40.13,41.15 | v40.13,50.29 28.96,50.29 MBED.P$23
PWM5  (via drill 0.6)
  Top 0.254: MBED.P$22 28.45,55.88 v38.61,55.88 | v42.67,53.85 44.2,52.32 44.2,48.77 43.69,48.26 43.69,41.66 42.67,40.64 42.67,35.56 45.21,33.02 MD2_R.7
  Bottom 0.254: v38.61,55.88 40.64,53.85 v42.67,53.85
PWM6  (via drill 0.6)
  Top 0.254: MBED.P$21 27.43,56.9 40.13,56.9 v40.64,56.39 | v42.67,55.88 46.23,52.32 MD2_R.1
  Bottom 0.254: v40.64,56.39 41.15,55.88 v42.67,55.88
RESET_N_BB  (via drill 0.6)
  Top 0.254: v10.67,55.88 8.13,58.42 8.13,58.8 BBB.56
  Bottom 0.254: XBEE.20 21.42,69.18 16.76,64.52 16.76,62.99 14.73,60.96 14.73,57.91 12.7,55.88 v10.67,55.88
RESET_N_MBED
  Bottom 0.254: MBED.NR 50.55,16.51 51.56,17.53 51.56,73.91 50.29,75.18 XBEE.4
RESET_XBEE  (via drill 0.6)
  Top 0.254: MBED.P$5 51.05,19.05 51.82,19.81 57.4,19.81 57.91,20.32 57.91,76.2 57.4,76.71 v51.82,76.71
  Bottom 0.254: v51.82,76.71 43.98,76.71 XBEE.5
RXD2
  Bottom 0.254: BBB.70 7.75,41.02 9.14,39.62 9.14,38.86 10.92,37.08 10.92,33.78 19.3,25.4 28.96,25.4 29.72,26.16 39.62,26.16 45.21,31.75 MBED.P$10
RXD2_BB
  Bottom 0.254: BBB.68 7.75,44.07 6.6,45.21 3.81,45.21 3.3,45.72 3.3,87.63 6.1,90.42 22.35,90.42 25.91,86.87 25.91,79.25 39.12,66.04 45.21,66.04 JP_RXD_XBEE.3
RXD_MBED
  Top 0.254: JP_RXD_XBEE.1 46.74,53.34 47.24,52.83 47.24,51.31 47.75,50.8 50.8,50.8 51.31,50.29 51.31,43.18 MBED.P$14
RXD_XBEE
  Top 0.254: JP_RXD_XBEE.2 46.23,65.02 44.7,66.55 44.7,70.61 44.08,70.61 XBEE.2
SCL
  Top 0.254: PRESSURE.6 IMU9.5 R2.1 13.65,13.21 12.19,13.21 11.68,13.72 11.68,16.26 12.7,17.27 17.27,17.27 18.29,18.29 23.37,18.29 25.4,20.32 25.4,26.92 24.89,27.43 23.11,27.43 JP_SCL.2
SCL_BB  (via drill 0.6)
  Top 0.254: v11.68,42.67 9.14,45.21 7.11,45.21 6.6,45.72 6.6,47.62 BBB.63
  Bottom 0.254: JP_SCL.3 18.8,29.46 16.76,31.5 16.76,32.77 14.99,34.54 14.99,40.39 12.7,42.67 v11.68,42.67
SCL_MBED  (via drill 0.6)
  Top 0.254: v28.45,27.94 28.96,28.45 28.96,41.15 28.45,41.66 27.43,41.66 MBED.P$27
  Bottom 0.254: JP_SCL.1 25.15,29.21 26.42,27.94 v28.45,27.94
SDA  (via drill 0.6)
  Top 0.254: PRESSURE.5 IMU9.4 R1.1 16.32,13.21 18.29,13.21 v18.8,13.72 | v18.8,16.76 19.3,17.27 23.88,17.27 25.91,19.3 25.91,29.97 25.4,30.48 22.61,30.48 JP_SDA.2
  Bottom 0.254: v18.8,13.72 v18.8,16.76
SDA_BB  (via drill 0.6)
  Top 0.254: BBB.64 7.75,48.64 12.19,44.2 12.19,43.69 13.72,42.16 v14.99,42.16
  Bottom 0.254: JP_SDA.3 16.76,33.78 16.76,39.12 16.76,39.62 16.76,40.64 15.24,42.16 v14.99,42.16
SDA_MBED
  Top 0.254: JP_SDA.1 23.88,32 25.4,33.53 25.4,36.58 26.92,38.1 26.92,39.12 MBED.P$28
SIGNAL+(GREEN)
  Top 0.406: HYDROPHONE.1 C11.1
TXD2
  Bottom 0.254: BBB.72 7.87,38.86 9.65,37.08 9.65,27.94 14.73,22.86 28.19,22.86 29.97,21.08 36.83,21.08 44.7,28.96 49.78,28.96 MBED.P$9
TXD2_BB
  Bottom 0.254: BBB.67 3.81,43.94 2.54,45.21 2.54,88.39 5.59,91.44 22.86,91.44 23.37,90.93 26.92,87.38 26.92,79.76 39.12,67.56 44.2,67.56 46.23,69.6 48.77,69.6 49.78,68.58 JP_TXD_XBEE.3
TXD_MBED  (via drill 0.6)
  Top 0.254: JP_TXD_XBEE.1 49.78,59.44 48.26,57.91 v48.26,52.32
  Bottom 0.254: v48.26,52.32 48.26,41.15 MBED.P$13
TXD_XBEE
  Top 0.254: JP_TXD_XBEE.2 48.77,65.02 48.26,65.53 48.26,68.58 47.75,69.09 46.99,69.09 45.21,70.87 45.21,71.37 44.7,71.88 44.7,72.64 44.2,73.15 43.54,73.15 XBEE.3
VDD_3V3EXP
  Top 0.254: BBB.50 BBB.49
VDD_5V
  Top 0.254: BBB.51 BBB.52
XBEE_ON_SLEEP  (via drill 0.6)
  Top 0.254: v28.96,84.84 28.96,84.33 27.94,83.31 21.65,83.31 XBEE.13
  Bottom 0.254: BBB.73 3.3,36.32 1.52,38.1 1.52,88.9 6.1,93.47 22.86,93.47 28.96,87.38 v28.96,84.84

### Text on the board
_tplace: Fish Control Board V1 | Jian